# Altium schematic sheet heater.SchDoc
size A4
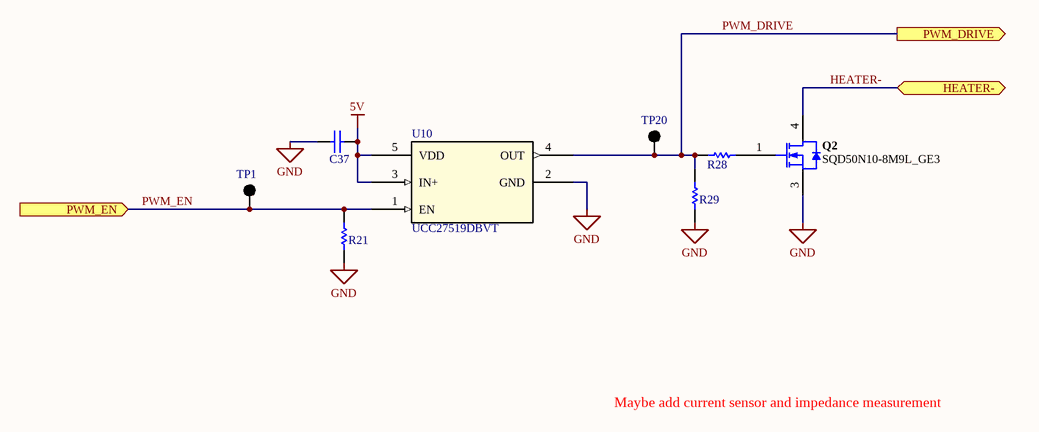
[diagram p0: heater.SchDoc]

## Parts
C37  Generic 0805 Capacitor  [0805]  (value not drawn)
Q2  SQD50N10-8M9L_GE3  [TO-252AA]
R21  Generic 0603 Resistor  [0603]  (value not drawn)
R28  Generic 0603 Resistor  [0603]  (value not drawn)
R29  Generic 0603 Resistor  [0603]  (value not drawn)
TP1  5001  [KSTN-5001]  (value not drawn)
TP20  5001  [KSTN-5001]  (value not drawn)
U10  UCC27519DBVT  [DBV5-M]

## Ports
HEATER- (bidir), PWM_DRIVE (out), PWM_EN (in)

## Nets
5V: C37.2 U10.3(IN+) U10.5(VDD)
GND: C37.1 Q2.3(S) R21.1 R29.1 U10.2(GND)
HEATER-: Q2.4(D) ; port HEATER-
PWM_DRIVE: R28.1 R29.2 TP20.1 U10.4(OUT) ; port PWM_DRIVE
PWM_EN: R21.2 TP1.1 U10.1(EN) ; port PWM_EN
NetQ2_1: Q2.1(G) R28.2

## Notes on the sheet
- Maybe add current sensor and impedance measurement
- Title
- Title:
- Project:
- Size:
- Date:
- File:
- E
- Number:
- Time:
- Revision:
- Sheet
- of

## Library data of the parts
C37 = C_0805: Value: *; Specifications: *
Q2 = SQD50N10: N-Channel 100V 50A (Tc) 136W (Tc) Surface Mount TO-252; Transistor Polarity: N-Channel; Product Category: MOSFET; Package Reference: TO-252AA; Package / Case: TO-252AA-3; Supplier 1: Digi-Key; Supplier Part Number 1: SQD50N10-8M9L_GE3CT-ND
R21 R28 R29 = R_0603: Value: *; Specifications: *
TP1 TP20 = TP5001: Test Point, Black, 1-Pin THD, RoHS, Bulk; Manufacturer: Keystone; Other Names: 5001K; Catalog Drawings: 5000Series; Alternate Color: 5004K-ND / -TESTPOINTPCMINI.040"DYELLOW / 5003K-ND / -TESTPOINTPCMINI.040"DORANGE / 5002K-ND / -TESTPOINTPCMINI.040"DWHITE / 5000K-ND / -TESTPOINTPCMINI.040"DRED; Kits: DKTGRS232C-KIT-ND / -TTLCONVERTER; Online Catalog: ColorCodedTestPoints; Datasheet URL: https://ciiva.com/datasheet-click-2917627?src=ciiva&sig=bd195616; Mounting Type: 0.040"(1.02mm)HoleDiameter; Family: TestPoints; RoHS Information: RoHSComplianceStatement; Datasheet Version: Rev. G, 12/2008; Color: Black; Category: TestandMeasurement; Standard Package: 100; Manufacturer URL: http://www.keyelco.com/; Material: Base,Nylon46,UL94V-0; Type: PCTestPoint,Miniature; Terminal: 0.010"x0.020"(0.25mmx0.51mm)PhosphorBronzeWire,SilverPlated; Series: THM; Packaging: Bulk
U10 = UCC27519: Low-Side Gate Driver IC Non-Inverting SOT-23-5